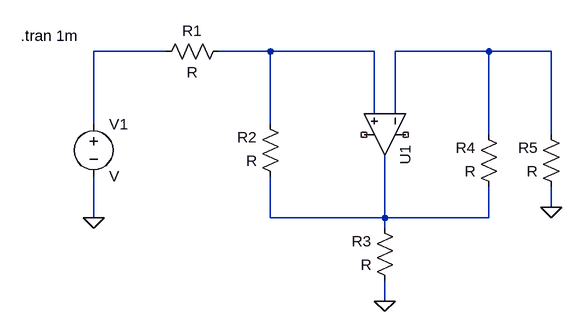
[diagram p0: schematic Q2 blank.asc]
Q2 blank.asc, the LTspice schematic file:
Version 4.1
SHEET 1 880 680
WIRE 48 16 -64 16
WIRE 208 16 128 16
WIRE 368 16 208 16
WIRE 544 16 400 16
WIRE 640 16 544 16
WIRE 368 112 368 16
WIRE 400 112 400 16
WIRE -64 128 -64 16
WIRE 208 128 208 16
WIRE 544 144 544 16
WIRE 640 144 640 16
WIRE 640 256 640 224
WIRE -64 272 -64 208
WIRE 208 272 208 208
WIRE 384 272 384 176
WIRE 384 272 208 272
WIRE 544 272 544 224
WIRE 544 272 384 272
WIRE 384 288 384 272
WIRE 384 400 384 368
FLAG -64 272 0
FLAG 640 256 0
FLAG 384 400 0
SYMBOL voltage -64 112 R0
SYMATTR InstName V1
SYMBOL res 144 0 R90
WINDOW 0 0 56 VBottom 2
WINDOW 3 32 56 VTop 2
SYMATTR InstName R1
SYMBOL res 224 224 R180
WINDOW 0 36 76 Left 2
WINDOW 3 36 40 Left 2
SYMATTR InstName R2
SYMBOL res 400 384 R180
WINDOW 0 36 76 Left 2
WINDOW 3 36 40 Left 2
SYMATTR InstName R3
SYMBOL res 560 240 R180
WINDOW 0 36 76 Left 2
WINDOW 3 36 40 Left 2
SYMATTR InstName R4
SYMBOL res 656 240 R180
WINDOW 0 36 76 Left 2
WINDOW 3 36 40 Left 2
SYMATTR InstName R5
SYMBOL OpAmps\\UniversalOpAmp1 384 144 R90
SYMATTR InstName U1
TEXT -176 -8 Left 2 !.tran 1m

The netlist it stands for:
* Q2 blank.asc
V1 N001 0 V
R1 N002 N001 R
R2 N004 N002 R
R3 0 N004 R
R4 N004 N003 R
R5 0 N003 R
X§U1 N002 N003 NC_01 NC_02 N004 level1 Avol=1Meg GBW=10Meg Vos=0 En=0 Enk=0 In=0 Ink=0 Rin=500Meg  ; pins In+ In- V+ V- OUT
.tran 1m
.lib UniversalOpAmp1.lib
.backanno
.end